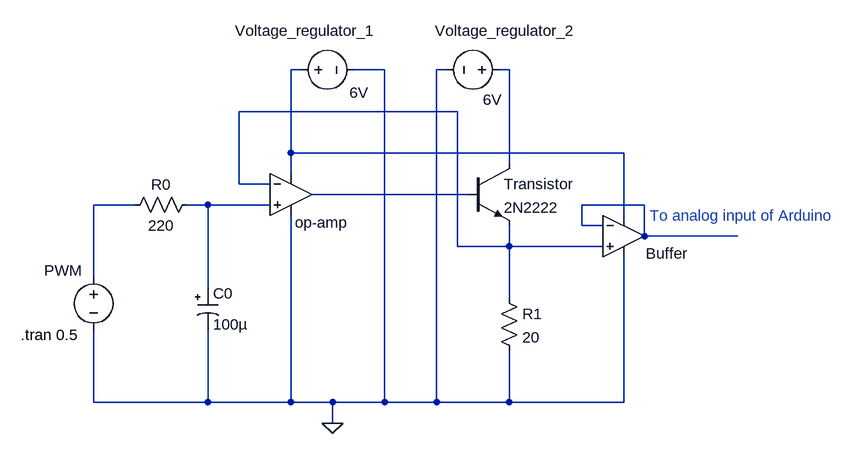
[diagram p0: schematic Current booster_2.asc]
Current booster_2.asc, the LTspice schematic file:
Version 4
SHEET 1 1136 680
WIRE 288 -2240 272 -2240
WIRE 416 -2240 368 -2240
WIRE 512 -2240 496 -2240
WIRE 608 -2240 592 -2240
WIRE 528 -2176 192 -2176
WIRE 272 -2112 272 -2240
WIRE 784 -2112 272 -2112
WIRE 608 -2096 608 -2240
WIRE 272 -2080 272 -2112
WIRE 192 -2064 192 -2176
WIRE 240 -2064 192 -2064
WIRE 544 -2048 304 -2048
WIRE 32 -2032 -32 -2032
WIRE 144 -2032 112 -2032
WIRE 240 -2032 144 -2032
WIRE 816 -2032 720 -2032
WIRE 784 -2016 784 -2112
WIRE 720 -2000 720 -2032
WIRE 752 -2000 720 -2000
WIRE 816 -1984 816 -2032
WIRE 960 -1984 816 -1984
WIRE 528 -1968 528 -2176
WIRE 608 -1968 608 -2000
WIRE 608 -1968 528 -1968
WIRE 752 -1968 608 -1968
WIRE -32 -1920 -32 -2032
WIRE 144 -1904 144 -2032
WIRE 608 -1888 608 -1968
WIRE -32 -1728 -32 -1840
WIRE 144 -1728 144 -1840
WIRE 144 -1728 -32 -1728
WIRE 272 -1728 272 -2016
WIRE 272 -1728 144 -1728
WIRE 336 -1728 272 -1728
WIRE 416 -1728 416 -2240
WIRE 416 -1728 336 -1728
WIRE 496 -1728 496 -2240
WIRE 496 -1728 416 -1728
WIRE 608 -1728 608 -1808
WIRE 608 -1728 496 -1728
WIRE 784 -1728 784 -1952
WIRE 784 -1728 608 -1728
WIRE 336 -1696 336 -1728
FLAG 336 -1696 0
SYMBOL OpAmps\\UniversalOpAmp 272 -2048 R0
WINDOW 0 6 43 Left 2
SYMATTR InstName op-amp
SYMBOL npn 544 -2096 R0
SYMATTR InstName Transistor
SYMATTR Value 2N2222
SYMBOL voltage -32 -1936 R0
WINDOW 0 -76 5 Left 2
WINDOW 123 0 0 Left 0
WINDOW 39 0 0 Left 0
WINDOW 3 24 96 Invisible 2
SYMATTR InstName PWM
SYMATTR Value PULSE(0 5 0 0 0 0.00040 0.00066 1000)
SYMBOL res 592 -1904 R0
SYMATTR InstName R1
SYMATTR Value 20
SYMATTR SpiceLine tol=1 pwr=1
SYMBOL polcap 128 -1904 R0
WINDOW 3 24 56 Left 2
SYMATTR Value 100µ
SYMATTR InstName C0
SYMATTR Description Capacitor
SYMATTR Type cap
SYMATTR SpiceLine V=10 Irms=1.9 Rser=0.04 Lser=0 mfg="SANYO" pn="10TPC100M" type="Tantalum"
SYMBOL res 128 -2048 R90
WINDOW 0 0 56 VBottom 2
WINDOW 3 32 56 VTop 2
SYMATTR InstName R0
SYMATTR Value 220
SYMBOL voltage 608 -2240 R90
WINDOW 0 -60 -104 VRight 2
WINDOW 3 46 11 VRight 2
WINDOW 123 0 0 Left 0
WINDOW 39 0 0 Left 0
SYMATTR InstName Voltage_regulator_2
SYMATTR Value 6V
SYMBOL voltage 272 -2240 R270
WINDOW 0 60 -86 VRight 2
WINDOW 3 -35 90 VRight 2
WINDOW 123 0 0 Left 0
WINDOW 39 0 0 Left 0
SYMATTR InstName Voltage_regulator_1
SYMATTR Value 6V
SYMBOL OpAmps\\UniversalOpAmp 784 -1984 R0
WINDOW 0 34 27 Left 2
SYMATTR InstName Buffer
TEXT -144 -1832 Left 2 !.tran 0.5
TEXT 824 -2016 Left 2 ;To analog input of Arduino

The netlist it stands for:
* Current booster_2.asc
Xop-amp N006 N003 N001 0 N004 level1 Avol=1Meg GBW=10Meg Vos=0 En=0 Enk=0 In=0 Ink=0 Rin=500Meg  ; pins In+ In- V+ V- OUT
Q§Transistor N002 N004 N003 0 2N2222
V§PWM N005 0 PULSE(0 5 0 0 0 0.00040 0.00066 1000)
R1 N003 0 20 tol=1 pwr=1
C0 N006 0 100µ V=10 Irms=1.9 Rser=0.04 Lser=0 mfg="SANYO" pn="10TPC100M" type="Tantalum"
R0 N006 N005 220
Voltage_regulator_2 N002 0 6V
Voltage_regulator_1 N001 0 6V
XBuffer N003 N007 N001 0 N007 level1 Avol=1Meg GBW=10Meg Vos=0 En=0 Enk=0 In=0 Ink=0 Rin=500Meg  ; pins In+ In- V+ V- OUT
.model NPN NPN
.model PNP PNP
.lib standard.bjt
.tran 0.5
* To analog input of Arduino
.lib UniversalOpAmp1.lib
.backanno
.end